# EAGLE design L298_Motor_Driver_Module (EAGLE 9.6.2)
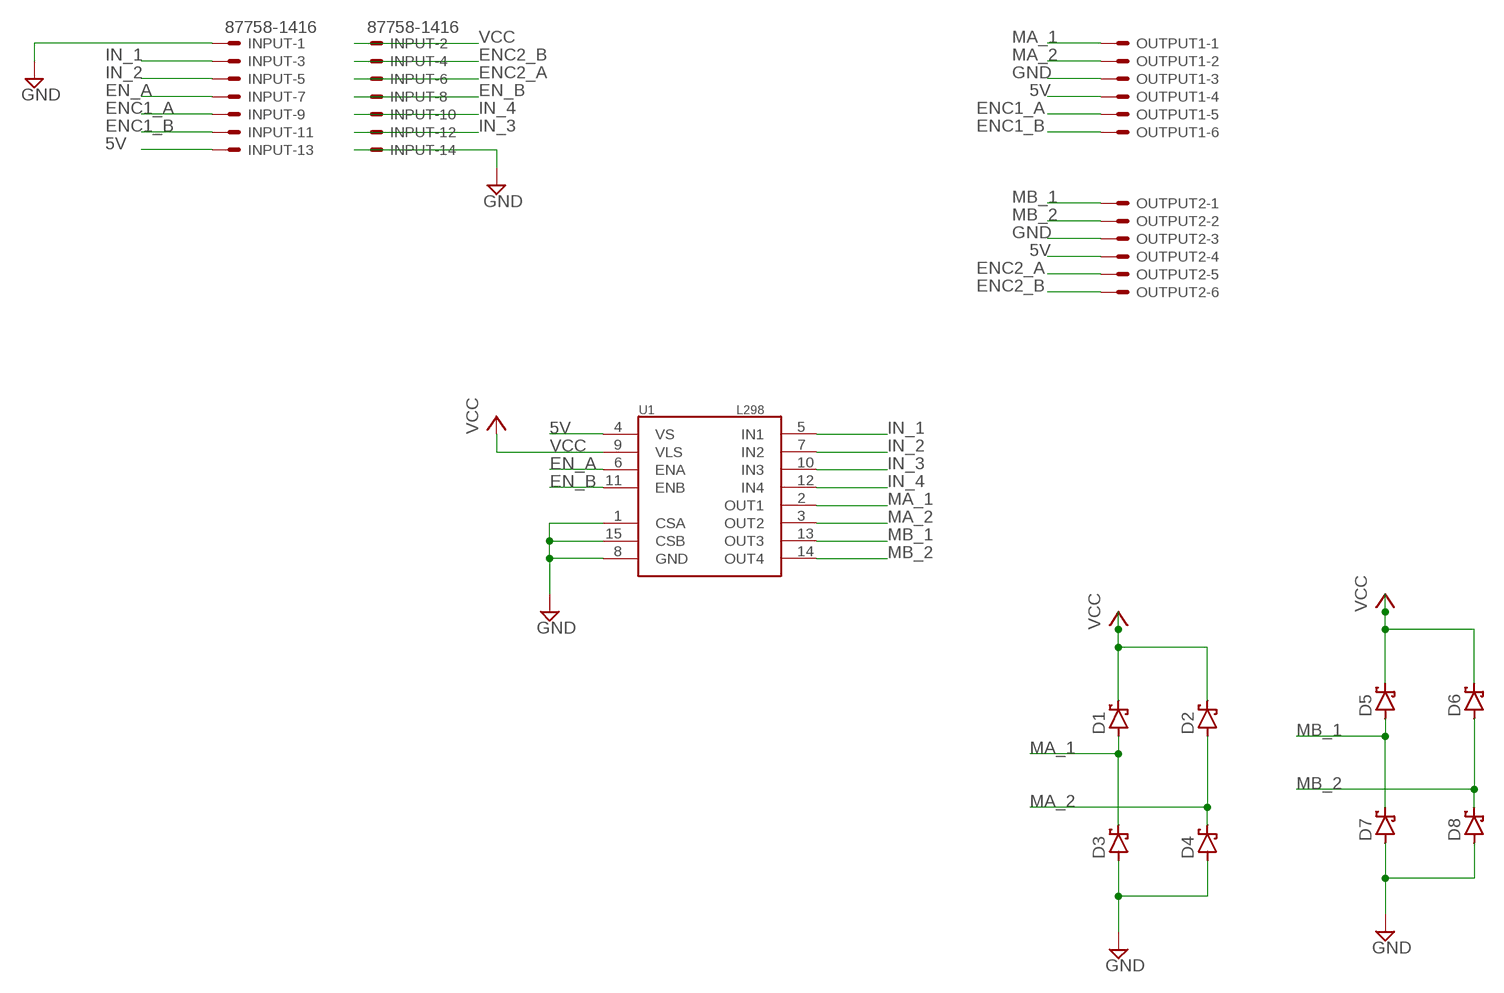
[diagram p0: schematic, sheet 1]

## Parts
D1  SCHOTTKY-DIODEDO35-7  [DO35-7]
D2  SCHOTTKY-DIODEDO35-7  [DO35-7]
D3  SCHOTTKY-DIODEDO35-7  [DO35-7]
D4  SCHOTTKY-DIODEDO35-7  [DO35-7]
D5  SCHOTTKY-DIODEDO35-7  [DO35-7]
D6  SCHOTTKY-DIODEDO35-7  [DO35-7]
D7  SCHOTTKY-DIODEDO35-7  [DO35-7]
D8  SCHOTTKY-DIODEDO35-7  [DO35-7]
INPUT  87758-1416  [87758-1416]
OUTPUT1  22-23-2061  [22-23-2061]
OUTPUT2  22-23-2061  [22-23-2061]
U1  L298  [MULTIWATT15]

## Nets
5V [POWER]: INPUT.13 OUTPUT1.4 OUTPUT2.4 U1.4(VS)
EN_A: INPUT.7 U1.6(ENA)
EN_B: INPUT.8 U1.11(ENB)
ENC1_A: INPUT.9 OUTPUT1.5
ENC1_B: INPUT.11 OUTPUT1.6
ENC2_A: INPUT.6 OUTPUT2.5
ENC2_B: INPUT.4 OUTPUT2.6
GND: D3.A D4.A D7.A D8.A INPUT.1 INPUT.14 OUTPUT1.3 OUTPUT2.3 U1.1(CSA) U1.8(GND) U1.15(CSB)
IN_1: INPUT.3 U1.5(IN1)
IN_2: INPUT.5 U1.7(IN2)
IN_3: INPUT.12 U1.10(IN3)
IN_4: INPUT.10 U1.12(IN4)
MA_1 [OUT]: D1.A D3.C OUTPUT1.1 U1.2(OUT1)
MA_2 [OUT]: D2.A D4.C OUTPUT1.2 U1.3(OUT2)
MB_1 [OUT]: D5.A D7.C OUTPUT2.1 U1.13(OUT3)
MB_2 [OUT]: D6.A D8.C OUTPUT2.2 U1.14(OUT4)
VCC [POWER]: D1.C D2.C D5.C D6.C INPUT.2 U1.9(VLS)

## Library data of the parts
D1-D8 = diode:SCHOTTKY-DIODE: Schottky Diode
INPUT = con-molex:87758-1416: 14 Pin - 2mm Dual Row Single Wafer, Vertical T/H HDR Source: http://www.molex.com/pdm_docs/sd/877580616_sd.pdf; MF: MOLEX; MPN: 87758-1416; OC_FARNELL: 7472358; OC_NEWARK: 59J1562
OUTPUT1 OUTPUT2 = con-molex:22-23-2061: .100" (2.54mm) Center Header - 6 Pin; MF: MOLEX; MPN: 22-23-2061; OC_FARNELL: 1462922; OC_NEWARK: 27C1933
U1 = SparkFun:L298: L298 Dual Full Bridge Driver

## Net classes
0 default: width 0.254 mm, drill 0.3 mm, clearance 0.15 mm
1 POWER: width 1 mm, drill 0.35 mm, clearance 0.3 mm
2 OUT: width 0.508 mm, drill 0.3 mm, clearance 0.2 mm

## Board
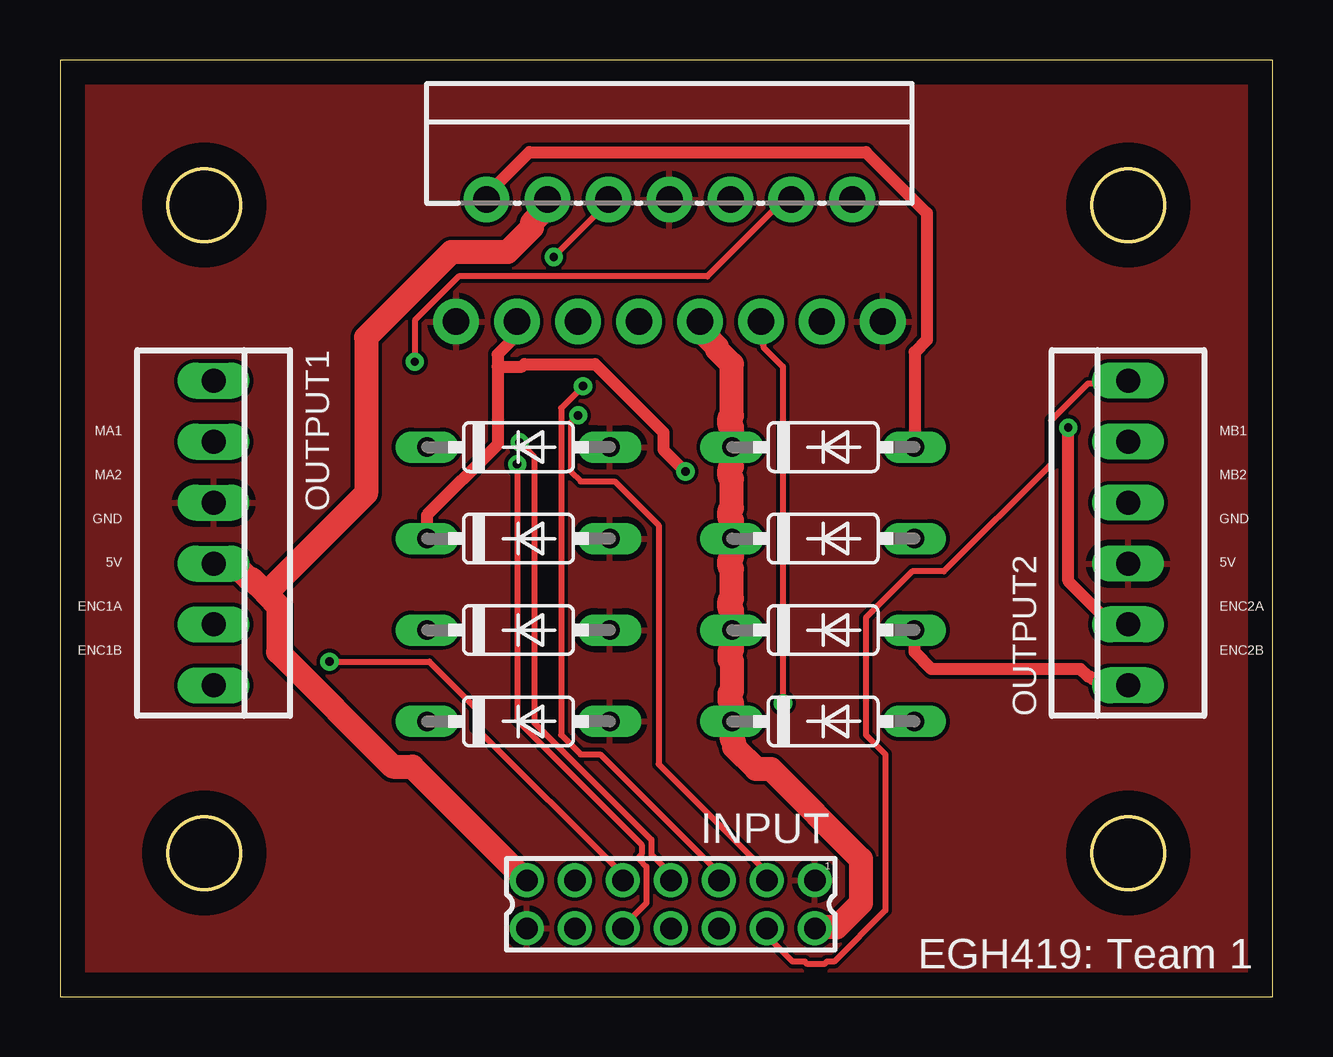
[diagram p1: board, top side]
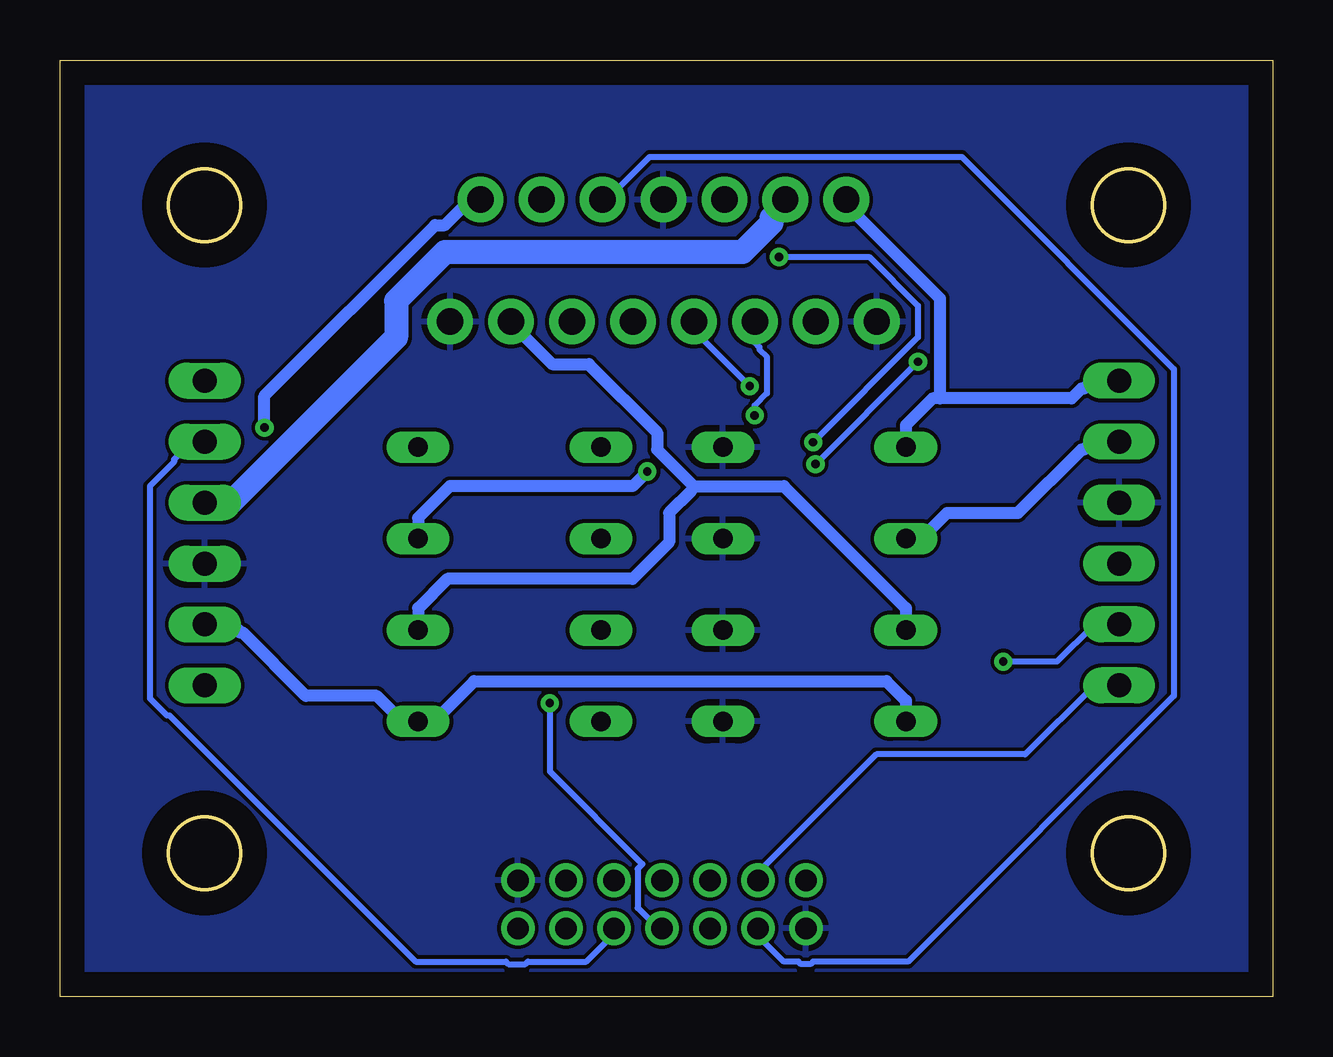
[diagram p2: board, bottom side, seen from below]

Size 50.53 x 39.04 mm. Coordinates in mm from the lower left corner, seen from the top.
Outline: 0,0 50.53,0 50.53,39.04 0,39.04 0,0
Outline: circle at 6.01,32.99 radius 1.5
Outline: circle at 6.01,5.99 radius 1.5
Outline: circle at 44.51,5.99 radius 1.5
Outline: circle at 44.51,32.99 radius 1.5
Copper layers (1*16): Top 0.035mm / dielectric 1.5mm / Bottom 0.035mm
Design rules "default": minimum track width 6mil, minimum drill 0.35mm, track to track 6mil, track to pad 6mil, pad to pad 6mil, via to via 6mil, smd to smd 6mil, copper to edge 40mil, drill to drill 6mil, minimum pad ring 10mil, minimum via ring 8mil, stop-mask expansion 4mil, vias tented up to drill 0mil, thermal gap 10mil

### Footprints (pad centres in the part's own frame; a part is rotated, then mirrored left to right if it is on the bottom)
DO35-7 = drill 0.813 long: A 3.81,0; C -3.81,0
87758-1416 = drill 0.9 pad 1.27: 1 -6,-1; 2 -6,1; 3 -4,-1; 4 -4,1; 5 -2,-1; 6 -2,1; 7 0,-1; 8 0,1; 9 2,-1; 10 2,1; 11 4,-1; 12 4,1; 13 6,-1; 14 6,1
22-23-2061 = drill 1 long: 1 -6.35,0; 2 -3.81,0; 3 -1.27,0; 4 1.27,0; 5 3.81,0; 6 6.35,0
MULTIWATT15 = drill 1.1 pad 1.9: 1 -8.95,-2.39; 2 -7.68,2.69; 3 -6.41,-2.39; 4 -5.14,2.69; 5 -3.87,-2.39; 6 -2.6,2.69; 7 -1.33,-2.39; 8 -0.06,2.69; 9 1.21,-2.39; 10 2.48,2.69; 11 3.75,-2.39; 12 5.02,2.69; 13 6.29,-2.39; 14 7.56,2.69; 15 8.83,-2.39

### Placement (x,y rotation side)
D1  31.8,22.91 0 top
D2  31.8,19.1 0 top
D3  19.1,22.91 0 top
D4  19.1,19.1 0 top
D5  31.8,15.29 0 top
D6  31.8,11.48 0 top
D7  19.1,15.29 0 top
D8  19.1,11.48 0 top
INPUT  25.45,3.86 180 top
OUTPUT1  6.4,19.33 270 top
OUTPUT2  44.5,19.33 90 top
U1  25.45,30.53 0 top

### Tracks (layer width: path | path; a pad name or v marks a point on that pad's centre or on a via)
5V
  Top 1: 8.58,16.81 7.97,17.42 7.87,17.42 7.26,18.03 6.45,18.03 OUTPUT1.4 | 8.58,16.81 9.09,16.31 9.09,14.38 13.87,9.6 14.68,9.6 19.35,4.93 INPUT.13 | 8.58,16.81 12.75,20.98 12.75,27.48 16.31,31.04 18.64,31.04 19.66,32.05 19.66,32.26 20.27,32.87 20.27,33.17 U1.4
  Bottom 1: OUTPUT2.4 44.45,20.57 43.43,20.57 36.52,27.48 36.52,29.01 34.49,31.04 22.1,31.04 20.88,32.26 20.88,32.46 20.37,32.97 20.37,33.17 U1.4
EN_A  (via drill 0.35)
  Top 0.254: INPUT.7 25.45,5.13 24.64,5.94 24.64,6.55 19.76,11.43 19.76,22.5 v19.15,23.11 | v20.57,30.84 22.91,33.17 U1.6
  Bottom 0.254: v19.15,23.11 14.78,27.48 14.78,28.8 16.81,30.84 v20.57,30.84
EN_B  (via drill 0.35)
  Top 0.254: v30.12,12.24 30.12,26.26 29.31,27.08 29.31,27.18 29.21,27.28 29.21,28.09 U1.11
  Bottom 0.254: v30.12,12.24 30.12,9.4 26.26,5.54 26.47,5.33 26.47,3.71 25.65,2.9 25.45,2.9 INPUT.8
ENC1_A  (via drill 0.35)
  Top 0.254: v11.23,13.97 15.39,13.97 17.32,12.04 17.32,11.23 23.42,5.13 23.42,4.93 INPUT.9
  Bottom 0.254: v11.23,13.97 8.99,13.97 7.47,15.49 6.45,15.49 OUTPUT1.5
ENC1_B
  Bottom 0.254: INPUT.11 21.39,4.93 21.39,5.23 16.51,10.11 10.31,10.11 7.47,12.95 6.45,12.95 OUTPUT1.6
ENC2_A
  Bottom 0.254: INPUT.6 27.48,2.79 27.48,2.59 28.6,1.47 31.04,1.47 31.14,1.37 31.85,1.37 31.95,1.47 35.71,1.47 45.97,11.73 46.07,11.73 46.79,12.45 46.79,21.28 45.77,22.3 45.77,22.4 45.06,23.11 44.55,23.11 OUTPUT2.5
ENC2_B
  Top 0.254: INPUT.4 29.51,2.79 29.51,2.49 30.53,1.47 31.04,1.47 31.14,1.37 31.85,1.37 31.95,1.47 32.26,1.47 34.39,3.61 34.39,10.11 33.58,10.92 33.58,15.8 35.51,17.73 36.83,17.73 41.3,22.2 41.3,24.03 42.82,25.55 44.35,25.55 44.45,25.65 OUTPUT2.6
GND
  pour Top: -13.49,36.99 -3.49,46.99 55.01,46.99 65.51,36.49 65.51,3.99 51.51,-10.01 30.01,-10.01 1.51,-10.01 -14.49,5.99 -14.49,35.99
  pour Bottom: -15.99,37.99 -5.99,47.99 41.01,47.99 51.51,47.99 67.51,31.99 67.51,6.99 56.01,-4.51 53.01,-7.51 9.01,-7.51 0.01,-7.51 -16.49,8.99 -16.49,37.49
IN_1  (via drill 0.35)
  Top 0.254: v21.59,24.23 21.28,23.93 21.28,21.89 21.69,21.49 23.11,21.49 24.94,19.66 24.94,9.7 29.41,5.23 29.41,4.93 INPUT.3
  Bottom 0.254: v21.59,24.23 21.59,24.64 21.08,25.15 21.08,26.67 21.39,26.97 21.39,27.08 21.59,27.28 21.59,28.09 U1.5
IN_2  (via drill 0.35)
  Top 0.254: v21.79,25.45 20.88,24.54 20.88,10.92 21.69,10.11 22.5,10.11 27.38,5.23 27.38,4.93 INPUT.5
  Bottom 0.254: v21.79,25.45 24.03,27.69 24.03,28.09 U1.7
IN_3
  Bottom 0.254: INPUT.12 21.39,2.79 21.39,2.49 20.37,1.47 19.76,1.47 19.66,1.37 19.25,1.37 19.15,1.47 15.19,1.47 4.11,12.55 4.11,26.16 12.95,35 25.96,35 27.69,33.27 27.89,33.27 U1.10
IN_4  (via drill 0.35)
  Top 0.254: v19.05,22.2 19.05,11.53 24.23,6.35 24.23,5.94 24.13,5.84 24.13,5.74 24.43,5.44 24.43,3.91 23.82,3.3 23.82,3.2 23.52,2.9 INPUT.10 | v14.78,26.47 14.78,28.19 16.61,30.02 26.97,30.02 30.12,33.17 30.43,33.17 U1.12
  Bottom 0.254: v14.78,26.47 v19.05,22.2
MA_1
  Top 0.508: D1.A 35.61,26.87 36.12,27.38 36.12,32.66 33.58,35.2 19.56,35.2 17.83,33.48 17.83,33.27 U1.2
  Bottom 0.508: D3.C 15.29,23.82 14.17,24.94 13.87,24.94 | 13.87,24.94 8.38,24.94 7.97,25.35 7.87,25.35 7.57,25.65 6.45,25.65 OUTPUT1.1 | 13.87,24.94 13.87,29.11 17.73,32.97 17.73,33.17 U1.2
MA_2  (via drill 0.35)
  Top 0.508: D4.C 15.29,20.07 18.24,23.01 18.24,26.26 | 18.24,26.26 18.24,26.77 18.95,27.48 18.95,28.09 U1.3 | v26.06,21.89 25.15,22.81 25.15,23.52 22.3,26.36 19.35,26.36 19.25,26.26 18.24,26.26
  Bottom 0.508: D2.A 35.61,19.96 34.29,21.28 26.67,21.28 v26.06,21.89 | OUTPUT1.2 6.45,23.11 7.57,23.11 7.87,22.81 7.97,22.81 10.62,20.17 13.56,20.17 14.58,19.15 15.29,19.15 D4.C
MB_1
  Top 0.508: D5.A 35.61,14.38 36.32,13.66 42.52,13.66 42.82,13.36 42.92,13.36 43.03,13.26 43.13,13.26 43.33,13.05 44.45,13.05 OUTPUT2.1
  Bottom 0.508: D7.C 15.29,16.2 20.37,21.28 24.13,21.28 | 24.13,21.28 25.65,22.81 25.65,23.52 28.5,26.36 30.02,26.36 31.75,28.09 U1.13 | D5.A 35.61,16.2 34.39,17.42 26.67,17.42 25.15,18.95 25.15,20.17 24.23,21.08 24.13,21.28
MB_2  (via drill 0.35)
  Top 0.508: v42.01,23.72 42.01,17.32 43.74,15.59 44.45,15.59 OUTPUT2.2
  Bottom 0.508: D8.C 15.29,12.34 16.1,13.16 33.27,13.16 34.9,11.53 35.61,11.53 D6.A 35.81,11.63 36.42,11.63 37.34,12.55 40.28,12.55 42.92,15.19 43.03,15.19 43.33,15.49 44.45,15.49 OUTPUT2.2 | v42.01,23.72 42.01,25.04 34.9,32.16 34.49,32.16 33.48,33.17 33.07,33.17 U1.14
VCC
  Top 1: INPUT.2 31.55,2.9 32.36,2.9 33.38,3.91 33.38,5.74 29.62,9.5 29.01,9.5 28.09,10.41 28.09,10.62 27.99,10.72 D6.C 27.99,12.24 27.89,12.34 27.89,12.65 27.99,12.75 27.99,13.97 27.89,14.07 27.89,14.38 27.99,14.48 D5.C 27.99,16.1 27.89,16.2 27.89,16.51 27.99,16.61 27.99,17.83 27.89,17.93 27.89,18.24 27.99,18.34 D2.C 27.99,19.86 27.89,19.96 27.89,20.27 27.99,20.37 27.99,21.59 27.89,21.69 27.89,22 27.99,22.1 D1.C 27.99,23.72 27.89,23.82 27.89,24.13 27.99,24.23 27.99,26.36 27.38,26.97 27.38,27.08 26.67,27.79 26.67,28.09 U1.9

### Text on the board
tNames: MA1 / / / MA2 / / / GND / / / 5V / / / ENC1A / / / ENC1B | MB1 / / / MB2 / / / GND / / / 5V / / / ENC2A / / / ENC2B | EGH419: Team 1
200bmp: C:/Users/CodyS/OneDrive - Queensland University of Technology/Uni Coursework/2021/EGH419 Group 1 Shared Folder/Git Stuff/EGH419/LOGO.bmp